# EAGLE design STl-Link-V303-small (EAGLE 7.6.0)
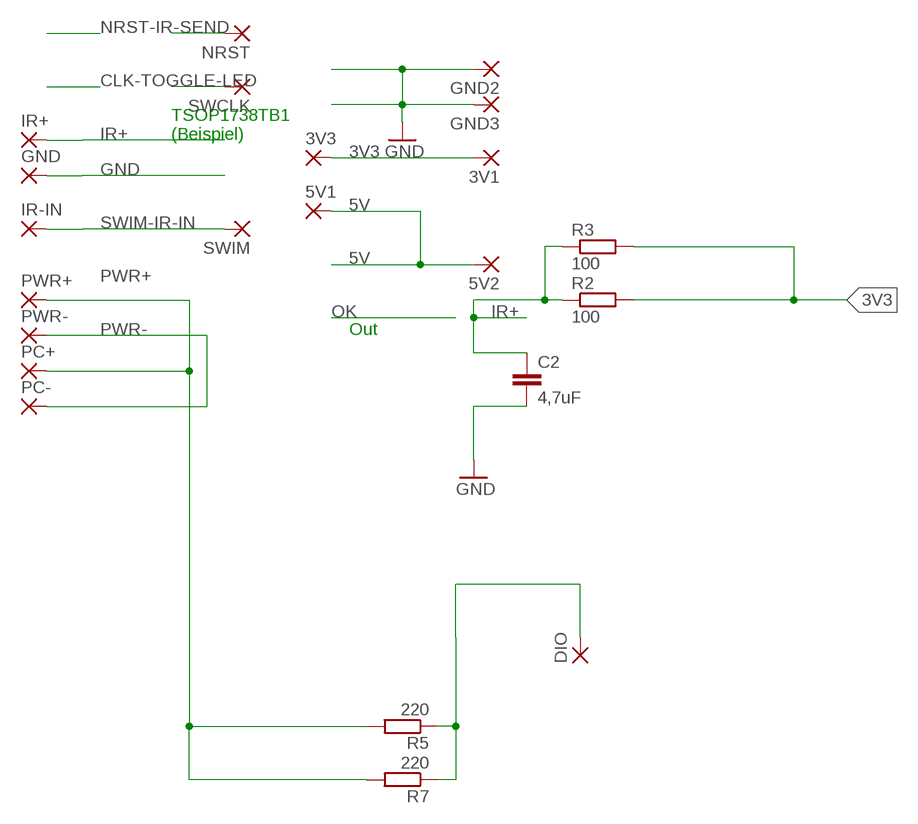
[diagram p0: schematic, sheet 1]

## Parts
3V1  SMD2  [SMD1,27-2,54]
3V3  SMD2  [SMD1,27-2,54]
5V1  SMD2  [SMD1,27-2,54]
5V2  SMD2  [SMD1,27-2,54]
C2  4,7uF  C-EUC1206K  [C1206K]
DIO  SMD2  [SMD1,27-2,54]
GND  SMD2  [SMD1,27-2,54]
GND2  SMD2  [SMD1,27-2,54]
GND3  SMD2  [SMD1,27-2,54]
IR+  SMD2  [SMD1,27-2,54]
IR-IN  SMD2  [SMD1,27-2,54]
NRST  SMD2  [SMD1,27-2,54]
PC+  SMD2  [SMD1,27-2,54]
PC-  SMD2  [SMD1,27-2,54]
PWR+  SMD2  [SMD1,27-2,54]
PWR-  SMD2  [SMD1,27-2,54]
R2  100  R-EU_0204/7  [0204/7]
R3  100  R-EU_R0805W  [R0805W]
R5  220  R-EU_0204/7  [0204/7]
R7  220  R-EU_R0805W  [R0805W]
SWCLK  SMD2  [SMD1,27-2,54]
SWIM  SMD2  [SMD1,27-2,54]

## Nets
3V3: 3V1.1(P) 3V3.1(P) R2.2 R3.2
5V [Power]: 5V1.1(P) 5V2.1(P)
CLK-TOGGLE-LED: SWCLK.1(P)
DIO-EINSCH: DIO.1(P) R5.1 R7.1
GND [Power]: C2.2 GND2.1(P) GND3.1(P) GND.1(P)
IR+: C2.1 IR+.1(P) R2.1 R3.1
N$1: NRST.1(P)
PWR+: PC+.1(P) PWR+.1(P) R5.2 R7.2
PWR-: PC-.1(P) PWR-.1(P)
SWIM-IR-IN: IR-IN.1(P) SWIM.1(P)

## Notes on the sheet
- TSOP1738TB1
  (Beispiel)
- Out

## Library data of the parts
3V1 3V3 5V1 5V2 DIO GND GND2 GND3 IR+ IR-IN NRST PC+ PC- PWR+ PWR- SWCLK SWIM = wirepad:SMD2: SMD PAD
C2 = rcl:C-EU: CAPACITOR, European symbol
R2 R3 R5 R7 = rcl:R-EU_: RESISTOR, European symbol

## Net classes
0 default: width 0.406 mm
1 Power: width 0.61 mm

## Board
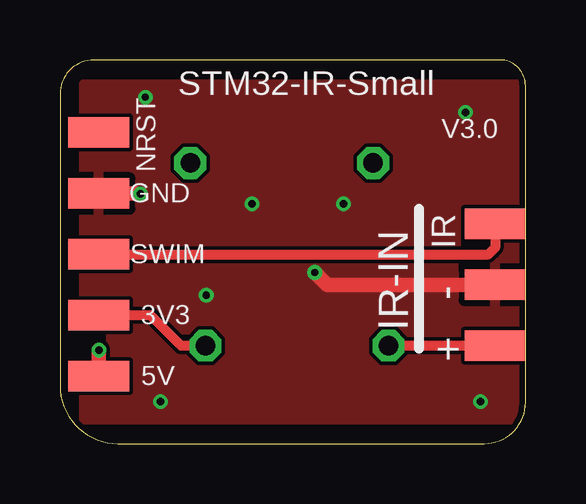
[diagram p1: board, top side]
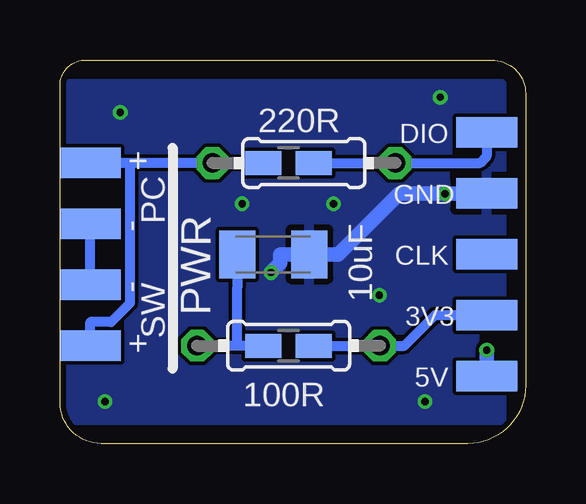
[diagram p2: board, bottom side, seen from below]

Size 19.4 x 16 mm. Coordinates in mm from the lower left corner, seen from the top.
Outline: 0,14.59 0,2.41 arc90 2.41,0 17.68,0 arc90 19.4,1.72 19.4,14.92 arc90 18.32,16 1.41,16 arc90 0,14.59
Copper layers (1*16): Top 0.035mm / dielectric 1.5mm / Bottom 0.035mm
Design rules "Fusion_eagle_rule_v1.1": minimum track width 6mil, minimum drill 12mil, track to track 6mil, track to pad 6mil, pad to pad 6mil, via to via 6mil, smd to smd 0mil, copper to edge 10mil, drill to drill 10mil, minimum pad ring 10mil, minimum via ring 6mil, stop-mask expansion 2mil, vias tented up to drill 100mil, thermal gap 10mil

### Footprints (pad centres in the part's own frame; a part is rotated, then mirrored left to right if it is on the bottom)
SMD1,27-2,54 = smd 1.27 x 2.54: 1 0,0
C1206K = smd 1.5 x 2: 1 -1.5,0; 2 1.5,0
0204/7 = drill 0.813 octagon: 1 -3.81,0; 2 3.81,0
R0805W = smd 1.5 x 1: 1 -1.052,0; 2 1.052,0

### Placement (x,y rotation side)
3V1  1.62,5.35 90 top
3V3  1.62,5.35 90 bottom
5V1  1.62,2.81 90 bottom
5V2  1.62,2.81 90 top
C2  10.51,7.89 0 bottom
DIO  1.62,12.97 90 bottom
GND  18.13,6.62 90 top
GND2  1.62,10.43 90 top
GND3  1.62,10.43 90 bottom
IR+  18.13,4.08 90 top
IR-IN  18.13,9.16 90 top
NRST  1.62,12.97 90 top
PC+  18.13,11.7 90 bottom
PC-  18.13,9.16 90 bottom
PWR+  18.13,4.08 90 bottom
PWR-  18.13,6.62 90 bottom
R2  9.88,4.08 0 bottom
R3  9.88,4.08 0 bottom
R5  9.24,11.7 180 bottom
R7  9.88,11.7 180 bottom
SWCLK  1.62,7.89 90 bottom
SWIM  1.62,7.89 90 top

### Tracks (layer width: path | path; a pad name or v marks a point on that pad's centre or on a via)
3V3
  Top 0.406: R2.2 5.05,4.08 3.78,5.35 3V1.1
  Bottom 0.406: 3V1.1 3.78,5.35 5.05,4.08 R2.2 R3.2
5V  (via drill 0.3 pad 0.61)
  Top 0.61: 5V2.1 v1.62,3.9
  Bottom 0.61: 5V2.1 v1.62,3.9
DIO-EINSCH
  Bottom 0.406: DIO.1 1.62,11.98 1.9,11.7 R5.1 R7.1
GND  (via drill 0.3 pad 0.61)
  Top 0.61: v3.36,10.42 v3.35,10.42 v3.35,10.43 GND3.1 | GND.1 11.13,6.62 v10.61,7.13
  Bottom 0.61: GND3.1 v3.35,10.43 v3.36,10.42 5.27,10.42 7.8,7.89 C2.2 10.22,7.89 10.22,7.53 v10.61,7.13
  other vias: 8,10 11.81,10 16.89,13.81 17.52,1.75 4.19,1.75 6.1,6.19 3.55,14.45
  pour Bottom: 1,15 19,15 19,1 1,1
  pour Top: 1,1 1,15 19,15 19,1
IR+
  Top 0.406: IR+.1 R2.1
  Bottom 0.406: 12.01,4.08 R2.1 | R3.1 12.01,4.08 | 12.01,4.08 12.01,6.53 C2.1
PWR+
  Bottom 0.406: 16.5,11.7 PC+.1 | 16.5,11.7 R5.2 R7.2 | 16.5,11.7 16.5,5.84 17.27,5.07 18.13,5.07 PWR+.1
PWR-
  Bottom 0.406: PWR-.1 PC-.1
SWIM-IR-IN
  Top 0.406: IR-IN.1 18.13,8.17 17.85,7.89 SWIM.1

### Text on the board
tNames: STM32-IR-Small | V3.0 | NRST | GND | SWIM | IR | 3V3 | - | IR-IN | 5V | +
bNames: DIO | 220R | GND | + | PC | - | CLK | 3V3 | 10uF | - | PWR | SW | + | 5V | 100R
tValues: www.neuby.de